# Altium schematic sheet FSP-485.SchDoc
size A4
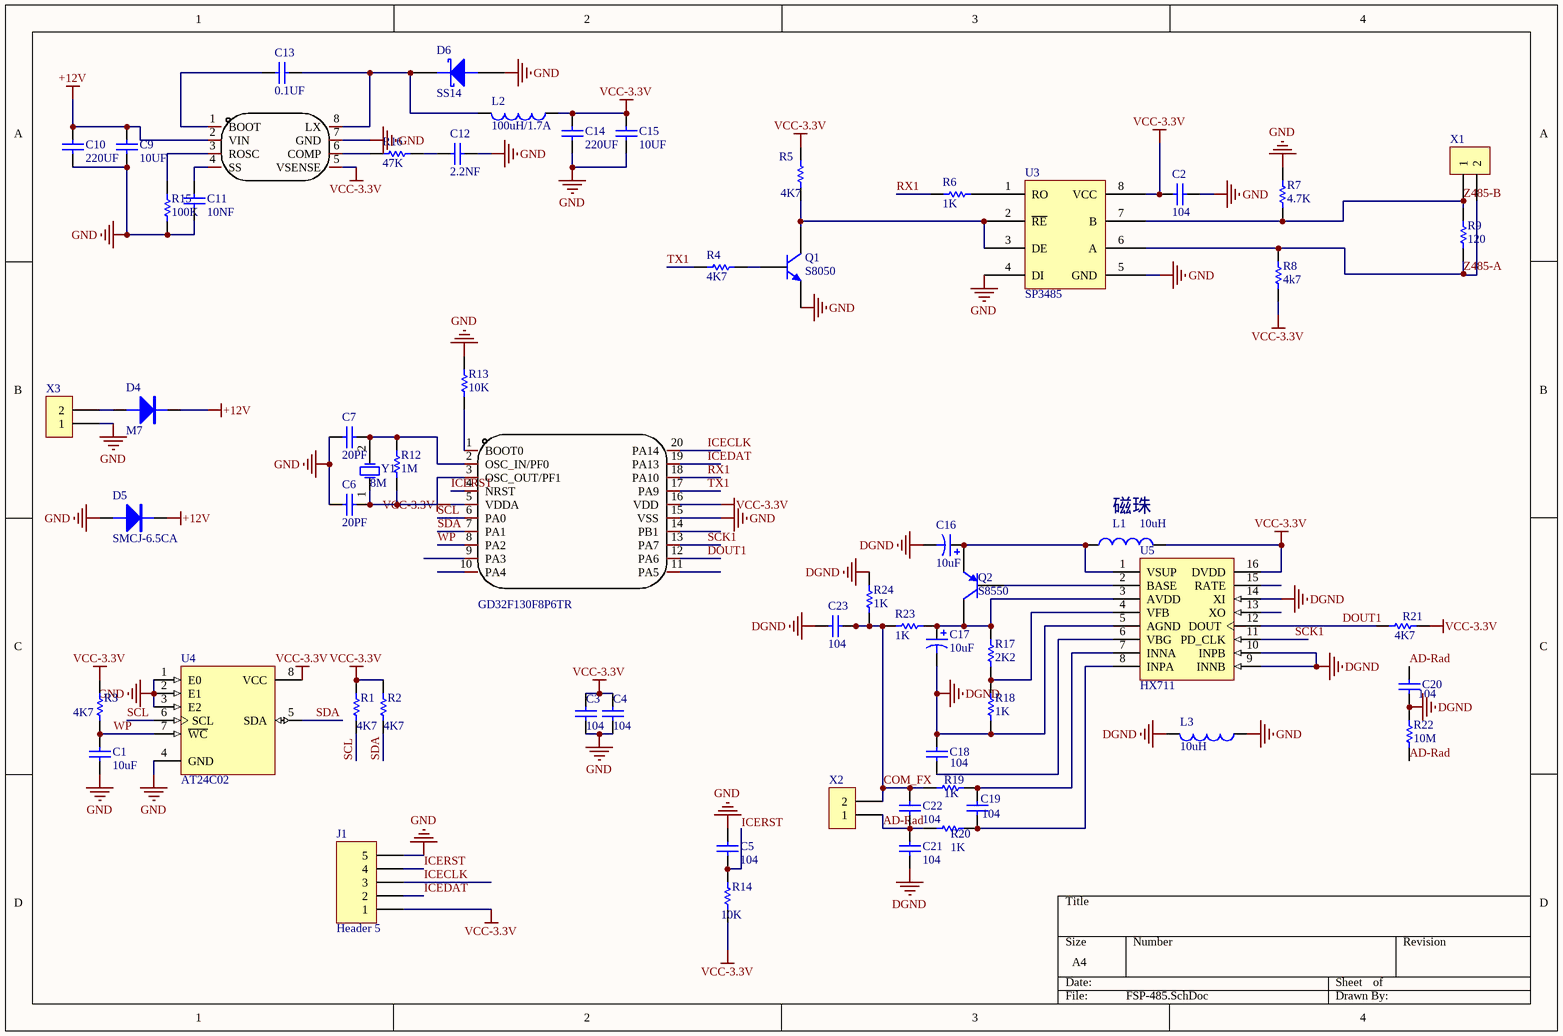
[diagram p0: FSP-485.SchDoc]

## Parts
C1  10uf  [R0603]
C2  104  [R0603]
C3  104  [R0603]
C4  104  [R0603]
C5  104  [R0603]
C6  20PF  [0805C]
C7  20PF  [0805C]
C9  10UF  [R0603]
C10  220UF  [CAP+_47UF_5X5]
C11  10NF  [R0603]
C12  2.2NF  [R0603]
C13  0.1UF  [R0603]
C14  220UF  [DAN-DIAN-RONG-1210]
C15  10UF  [R0603]
C16  10uf  [R0603]
C17  10uf  [R0603]
C18  104  [R0603]
C19  104  [R0603]
C20  104  [R0603]
C21  104  [R0603]
C22  104  [R0603]
C23  104  [R0603]
D4  M7  [DIODE]
D5  SMCJ-6.5CA  [DIODE]
D6  SS14  [DIODE]
J1  Header 5  [HDR1X5]
L1  10uH  [R0603]
L2  value 100uH/1.7A  [SMD-6*6MM]  (hidden comment: Inductor)
L3  10uH  [R0603]
Q1  S8050  [Q8050]
Q2  S8550  [Q8550]
R1  4K7  [R0603]
R2  4K7  [R0603]
R3  4K7  [R0603]
R4  4K7  [R0603]
R5  4K7  [R0603]
R6  1K  [R0603]
R7  value 4.7K  [R0603]  (hidden comment: 4K7)
R8  4K7  [R0603]
R9  120  [R0603]
R12  1M  [R0603]
R13  10K  [R0603]
R14  10K  [R0603]
R15  100K  [R0603]
R16  47K  [R0603]
R17  2K2  [R0603]
R18  1K  [R0603]
R19  1K  [R0603]
R20  1K  [R0603]
R21  4K7  [R0603]
R22  10M  [R0603]
R23  1K  [R0603]
R24  1K  [R0603]
U1  GD32F130F8P6TR  [GD32F130F8P6TR]
U2  TPS5403DR  [TPS5403DR]  (value not drawn)
U3  SP3485  [MAX485]
U4  AT24C02  [AT24C02]
U5  HX711  [HX711]
X1  (no value)  [CON-2.54mm*2]
X2  (no value)  [CON-2.54mm*2]
X3  (no value)  [CON-2.54mm*2]
Y1  8M  [XTAL-T]

## Nets
+12V: C9.1 C10.1 D4.2(K) D5.2(K) U2.2(VIN)
DGND: C16.2 C17.2 C18.2 C20.2 C21.2 C23.2 L3.1 R18.2 R22.2 R24.1 U5.5(AGND) U5.9(INNB) U5.10(INPB) U5.14(XI)
GND: C1.1 C2.2 C3.2 C4.2 C5.2 C6.2 C7.2 C9.2 C10.2 C11.2 C12.2 C14.1 C15.2 D5.1(A) D6.1(A) J1.5 L3.2 Q1.1(E) R7.2 R13.2 R15.2 U1.15(VSS) U2.7(GND) U3.4(DI) U3.5(GND) U4.1(E0) U4.2(E1) U4.3(E2) U4.4(GND) X3.1
VCC-3.3V: C2.1 C3.1 C4.1 C14.2 C15.1 J1.1 L1.2 L2.2 R1.2 R2.2 R3.2 R5.1 R8.2 R14.2 R21.1 U1.5(VDDA) U1.16(VDD) U2.5(VSENSE) U3.8(VCC) U4.8(VCC) U5.16(DVDD)
AD-Rad: C20.1 C21.1 C22.1 R20.1 R22.1 X2.1
COM_FX: C22.2 C23.1 R19.1 R23.1 R24.2 X2.2
DOUT1: R21.2 U1.12(PA6) U5.12(DOUT)
ICECLK: J1.3 U1.20(PA14)
ICEDAT: J1.2 U1.19(PA13)
ICERST: C5.1 J1.4 R14.1 U1.4(NRST)
RX1: R6.2 U1.18(PA10)
SCK1: U1.13(PA7) U5.11(PD_CLK)
SCL: R1.1 U1.6(PA0) U4.6(SCL)
SDA: R2.1 U1.7(PA1) U4.5(SDA)
TX1: R4.1 U1.17(PA9)
WP: C1.2 R3.1 U1.8(PA2) U4.7(~{WC})
Z485-A: R8.1 R9.2 U3.6(A) X1.2
Z485-B: R7.1 R9.1 U3.7(B) X1.1
NetC6_1: C6.1 R12.2 U1.3(OSC_OUT/PF1) Y1.1(OSC1)
NetC7_1: C7.1 R12.1 U1.2(OSC_IN/PF0) Y1.2(OSC2)
NetC11_1: C11.1 U2.4(SS)
NetC12_1: C12.1 R16.1
NetC13_1: C13.1 U2.1(BOOT)
NetC13_2: C13.2 D6.2(K) L2.1 U2.8(LX)
NetC16_1: C16.1 L1.1 Q2.1(E) U5.1(VSUP)
NetC17_1: C17.1 Q2.3(C) R17.1 R23.2 U5.3(AVDD)
NetC18_1: C18.1 U5.6(VBG)
NetC19_1: C19.1 R20.2 U5.8(INPA)
NetC19_2: C19.2 R19.2 U5.7(INNA)
NetD4_1: D4.1(A) X3.2
NetQ1_2: Q1.2(B) R4.2
NetQ1_3: Q1.3(C) R5.2 U3.2(~{RE}) U3.3(DE)
NetQ2_2: Q2.2(B) U5.2(BASE)
NetR6_1: R6.1 U3.1(RO)
NetR13_1: R13.1 U1.1(BOOT0)
NetR15_1: R15.1 U2.3(ROSC)
NetR16_2: R16.2 U2.6(COMP)
NetR17_2: R17.2 R18.1 U5.4(VFB)

Not connected (* = marked no-connect by the designer): U1 9(PA3) 10(PA4) 11(PA5) 14(PB1); U5 13(XO) 15(RATE)

## Notes on the sheet
- (near L1) 磁珠

## Library data of the parts
C1-C7 C9-C15 C18-C23 = Cap: Capacitor; Published: 8-Jun-2000; LatestRevisionDate: 17-Jul-2002; LatestRevisionNote: Re-released for DXP Platform.; PackageReference: RAD-0.3; Publisher: Altium Limited
  C1: Value: 10uF
  C2-C5 C18-C23: Value: 104
  C6 C7: Value: 20PF
  C9 C15: Value: 10UF
  C10 C14: Value: 220UF
  C11: Value: 10NF
  C12: Value: 2.2NF
  C13: Value: 0.1UF
C16 C17 = Cap Pol3: Polarized Capacitor (Surface Mount); Published: 8-Jun-2000; LatestRevisionDate: 17-Jul-2002; LatestRevisionNote: Re-released for DXP Platform.; PackageReference: C0805; Publisher: Altium Limited; Value: 10uF
D4 D5 = DIODE
D6 = DIODE SCHOTTKY: Schottky Diode
J1 = Header 5: Header, 5-Pin; LatestRevisionDate: 17-Jul-2002; LatestRevisionNote: Re-released for DXP Platform.; Publisher: Altium Limited
L1-L3 = Inductor: Code_IEC: 1005; Published: 8-Jun-2000; LatestRevisionDate: 17-Jul-2002; LatestRevisionNote: Re-released for DXP Platform.; PackageReference: 0402-A; Publisher: Altium Limited; Code_JEITA: 0402
  L1 L3: Value: 10uH
Q1 = 2N3904: NPN General Purpose Amplifier; Published: 8-Jun-2000; LatestRevisionDate: 15-Jan-2003; LatestRevisionNote: PCB Footprint 'BCY-W3/D4.7' replaced; DatasheetDocument: 1997; PackageDocument: Sep-1998; PackageReference: TO-92A; Publisher: Altium Limited; Code_JEDEC: TO-92A; ComponentLink1Description: Manufacturer Link; ComponentLink1URL: http://www.fairchildsemi.com/; ComponentLink2Description: Datasheet; ComponentLink2URL: http://www.fairchildsemi.com/ds/2N%2F2N3904.pdf
Q2 = 2N3906: PNP General Purpose Amplifier; Published: 8-Jun-2000; LatestRevisionDate: 15-Jan-2003; LatestRevisionNote: PCB Footprint 'BCY-W3/D4.7' replaced; DatasheetDocument: 1997; PackageDocument: Sep-1998; PackageReference: TO-92A; Publisher: Altium Limited; Code_JEDEC: TO-92A; ComponentLink1Description: Manufacturer Link; ComponentLink1URL: http://www.fairchildsemi.com/; ComponentLink2Description: Datasheet; ComponentLink2URL: http://www.fairchildsemi.com/ds/2N%2F2N3906.pdf
R1-R9 R12-R24 = Res1: Resistor; Published: 8-Jun-2000; LatestRevisionDate: 17-Jul-2002; LatestRevisionNote: Re-released for DXP Platform.; PackageReference: AXIAL-0.3; Publisher: Altium Limited
  R1-R5 R21: Value: 4K7
  R6 R18-R20 R23 R24: Value: 1K
  R8: Value: 4k7
  R9: Value: 120
  R12: Value: 1M
  R13 R14: Value: 10K
  R15: Value: 100K
  R16: Value: 47K
  R17: Value: 2K2
  R22: Value: 10M
U1 = GD32F130F8P6TR: Manufacturer: GigaDevice(兆易创新); Add into BOM: yes; CPU Core: ARM Cortex-M3; Maximum Frequency: 72MHz; Supply Voltage Range: 2.6V~3.6V; Internal Oscillator: 有; External Clock Frequency Rang: 4MHz~32MHz; Program FLASH Size: 64KB; RAM Size: 8KB; GPIO Ports Number: 15; ADC (Units/Channels/bits): 1@x9ch/12bit; (E)PWM (Units/Channels/bits): 1@x16bit; 16Bit Timer Number: 4; 32Bit Timer Number: 1; U(S)ART Number: 2; Peripherals / Functions / Protocol Stacks: 片载温度传感器；DMA；看门狗；LIN总线协议；PWM；除法器；IrDA；乘法器；RTC实时时钟; Name: GD32F130F8P6TR; Symbol: GD32F130F8P6; Device: GD32F130F8P6TR; LCSC Part Name: GD32F130F8P6TR; Supplier Part: C94541; Manufacturer Part: GD32F130F8P6TR; Supplier Footprint: TSSOP-20; JLCPCB Part Class: Extended Part; Datasheet: https://atta.szlcsc.com/upload/public/pdf/source/20180508/C94541_55DE43D6915F19E5F0C5B549391C719F.pdf; Supplier: LCSC; Convert to PCB: yes; EEPROM/Data FLASH Size: -; DAC (Units/Channels/bits): -; 8Bit Timer Number: -; CMP Number: -; I2C Number: 2; I2S Number: -; (Q)SPI Number: 2; CAN Number: -; USB (H/D/OTG): -; Operating Temperature Range: -40℃~+85℃
U2 = TPS5403DR: Manufacturer: TI(德州仪器); Add into BOM: yes; Function: 降压型; Synchronous Rectification: 否; Output Type: 固定; Number of Outputs: 1; Topology: 降压式; Input Voltage: 4.5V~28V; Output Voltage: 3.3V; Output Current (Max): 1.7A; Switching Frequency: 1.1MHz; Name: TPS5403DR; Symbol: TPS5403DR; Device: TPS5403DR; LCSC Part Name: 降压型 输入4.5V~28V 输出3.3V 1.7A; Supplier Part: C962080; Manufacturer Part: TPS5403DR; Supplier Footprint: SOIC-8; JLCPCB Part Class: Extended Part; Datasheet: https://atta.szlcsc.com/upload/public/pdf/source/20230222/91741523B3EAF9D96C10B44D8053CCAE.pdf; Supplier: LCSC; Convert to PCB: yes; Operating Temperature: -40℃~+85℃@(TA)
U3 = MAX485
U4 = M24C02BN6: 2Kbit Serial I睠 Bus EEPROM; Published: 24-Aug-2001; LatestRevisionDate: 06-Jun-2005; LatestRevisionNote: Stylized 3D Model Added.; DatasheetVersion: Sep-1999; PackageVersion: Jun-1998; PackageReference: PSDIP8A; Publisher: Altium Limited; PackageDescription: DIP; 8 Leads; Row Spacing 7.62 mm; Pitch 2.54 mm; ComponentLink1Description: Manufacturer Link; ComponentLink1URL: http://www.st.com/; ComponentLink2Description: Datasheet; ComponentLink2URL: http://www.st.com/stonline/products/literature/ds/5067/m24c01-r.pdf
X1-X3 = CON2: Connector
Y1 = XTAL: Crystal Oscillator; Published: 8-Jun-2000; LatestRevisionDate: 17-Jul-2002; LatestRevisionNote: Re-released for DXP Platform.; PackageReference: R38; Publisher: Altium Limited